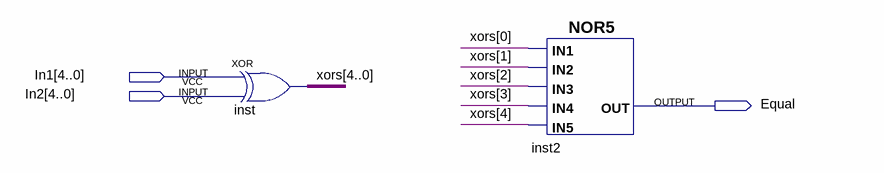
[diagram p0: schematic sheet]
// Quartus schematic Compare5.bdf as structural Verilog: 2 symbols, 3 pins
module Compare5 (
  input  [4:0] In1,
  input  [4:0] In2,
  output Equal
);

  wire [4:0] xors;

  assign xors = In1 ^ In2;  // XOR inst, 5 bits wide
  nor inst2 (Equal, xors[0], xors[1], xors[2], xors[3], xors[4]);
endmodule
